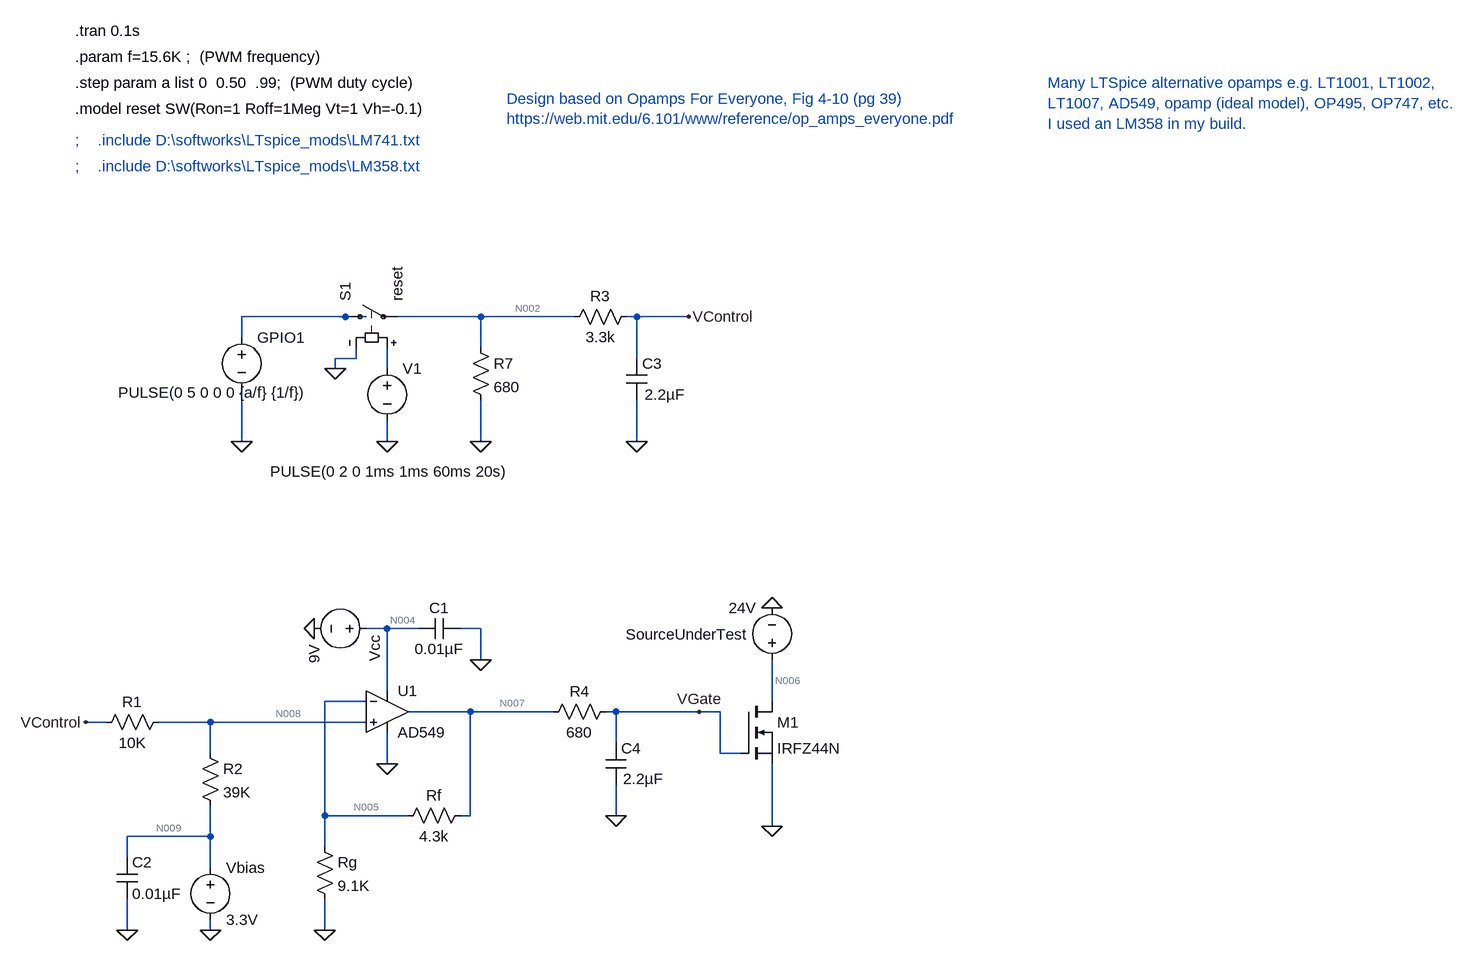
[diagram p0: schematic ConstCurrDriver.asc]
ConstCurrDriver.asc, the LTspice schematic file:
Version 4
SHEET 1 1688 1016
WIRE -928 48 -1088 48
WIRE -896 48 -928 48
WIRE -720 48 -848 48
WIRE -576 48 -720 48
WIRE -480 48 -496 48
WIRE -400 48 -480 48
WIRE -1088 80 -1088 48
WIRE -720 96 -720 48
WIRE -912 112 -912 96
WIRE -912 112 -944 112
WIRE -480 112 -480 48
WIRE -944 128 -944 112
WIRE -864 128 -864 96
WIRE -1088 240 -1088 160
WIRE -864 240 -864 208
WIRE -720 240 -720 176
WIRE -480 240 -480 176
WIRE -864 528 -896 528
WIRE -816 528 -864 528
WIRE -720 528 -752 528
WIRE -720 576 -720 528
WIRE -864 624 -864 528
WIRE -896 640 -960 640
WIRE -272 640 -272 576
WIRE -736 656 -832 656
WIRE -608 656 -736 656
WIRE -512 656 -528 656
WIRE -384 656 -512 656
WIRE -352 656 -384 656
WIRE -1296 672 -1328 672
WIRE -1136 672 -1216 672
WIRE -896 672 -1136 672
WIRE -512 704 -512 656
WIRE -1136 720 -1136 672
WIRE -352 720 -352 656
WIRE -320 720 -352 720
WIRE -864 736 -864 688
WIRE -960 816 -960 640
WIRE -832 816 -960 816
WIRE -736 816 -736 656
WIRE -736 816 -752 816
WIRE -512 816 -512 768
WIRE -272 832 -272 736
WIRE -1136 848 -1136 800
WIRE -1136 848 -1264 848
WIRE -960 864 -960 816
WIRE -1264 880 -1264 848
WIRE -1136 896 -1136 848
WIRE -1264 992 -1264 944
WIRE -1136 992 -1136 976
WIRE -960 992 -960 944
FLAG -1136 992 0
FLAG -960 992 0
FLAG -864 736 0
FLAG -720 576 0
FLAG -1264 992 0
FLAG -272 832 0
FLAG -480 240 0
FLAG -1088 240 0
FLAG -512 816 0
FLAG -864 240 0
FLAG -944 128 0
FLAG -976 528 0
FLAG -720 240 0
FLAG -272 496 0
FLAG -384 656 VGate
FLAG -400 48 VControl
FLAG -1328 672 VControl
SYMBOL voltage -1136 880 R0
WINDOW 123 0 0 Left 0
WINDOW 39 0 0 Left 0
SYMATTR InstName Vbias
SYMATTR Value 3.3V
SYMBOL res -736 800 R90
WINDOW 0 0 56 VBottom 2
WINDOW 3 32 56 VTop 2
SYMATTR InstName Rf
SYMATTR Value 4.3k
SYMBOL res -976 848 R0
SYMATTR InstName Rg
SYMATTR Value 9.1K
SYMBOL res -1152 704 R0
SYMATTR InstName R2
SYMATTR Value 39K
SYMBOL res -1200 656 R90
WINDOW 0 0 56 VBottom 2
WINDOW 3 32 56 VTop 2
SYMATTR InstName R1
SYMATTR Value 10K
SYMBOL cap -1280 880 R0
SYMATTR InstName C2
SYMATTR Value 0.01µF
SYMBOL cap -752 512 R90
WINDOW 0 0 32 VBottom 2
WINDOW 3 32 32 VTop 2
SYMATTR InstName C1
SYMATTR Value 0.01µF
SYMBOL nmos -320 640 R0
SYMATTR InstName M1
SYMATTR Value IRFZ44N
SYMBOL voltage -272 592 R180
WINDOW 123 0 0 Left 2
WINDOW 39 0 0 Left 2
WINDOW 0 35 55 Left 2
SYMATTR InstName SourceUnderTest
SYMATTR Value 24V
SYMBOL cap -496 112 R0
WINDOW 3 28 56 Left 2
SYMATTR Value 2.2µF
SYMATTR InstName C3
SYMBOL res -480 32 R90
WINDOW 0 0 56 VBottom 2
WINDOW 3 32 56 VTop 2
SYMATTR InstName R3
SYMATTR Value 3.3k
SYMBOL voltage -1088 64 R0
WINDOW 123 0 0 Left 2
WINDOW 39 0 0 Left 2
WINDOW 3 -190 101 Left 2
SYMATTR Value PULSE(0 5 0 0 0 {a/f} {1/f})
SYMATTR InstName GPIO1
SYMBOL res -512 640 R90
WINDOW 0 0 56 VBottom 2
WINDOW 3 32 56 VTop 2
SYMATTR InstName R4
SYMATTR Value 680
SYMBOL cap -528 704 R0
WINDOW 3 27 55 Left 2
SYMATTR Value 2.2µF
SYMATTR InstName C4
SYMBOL sw -944 48 R270
SYMATTR InstName S1
SYMATTR Value reset
SYMBOL voltage -864 112 R0
WINDOW 123 0 0 Left 0
WINDOW 39 0 0 Left 0
WINDOW 3 -180 174 Left 2
SYMATTR Value PULSE(0 2 0 1ms 1ms 60ms 20s)
SYMATTR InstName V1
SYMBOL voltage -880 528 R90
WINDOW 0 11 3 Left 2
WINDOW 123 0 0 Left 0
WINDOW 39 0 0 Left 0
SYMATTR InstName Vcc
SYMATTR Value 9V
SYMBOL res -736 80 R0
SYMATTR InstName R7
SYMATTR Value 680
SYMBOL Opamps\\AD549 -864 592 R0
SYMATTR InstName U1
TEXT -1344 -224 Left 2 ;;    .include D:\\softworks\\LTspice_mods\\LM741.txt
TEXT -680 -288 Left 2 ;Design based on Opamps For Everyone, Fig 4-10 (pg 39)\nhttps://web.mit.edu/6.101/www/reference/op_amps_everyone.pdf
TEXT -1344 -392 Left 2 !.tran 0.1s
TEXT -1344 -312 Left 2 !.step param a list 0  0.50  .99;  (PWM duty cycle)
TEXT -1344 -352 Left 2 !.param f=15.6K ;  (PWM frequency)
TEXT -1344 -272 Left 2 !.model reset SW(Ron=1 Roff=1Meg Vt=1 Vh=-0.1)
TEXT 152 -312 Left 2 ;Many LTSpice alternative opamps e.g. LT1001, LT1002, \nLT1007, AD549, opamp (ideal model), OP495, OP747, etc.\nI used an LM358 in my build.
TEXT -1344 -184 Left 2 ;;    .include D:\\softworks\\LTspice_mods\\LM358.txt

The netlist it stands for:
* ConstCurrDriver.asc
Vbias N009 0 3.3V
Rf N007 N005 4.3k
Rg N005 0 9.1K
R2 N008 N009 39K
R1 N008 VControl 10K
C2 N009 0 0.01µF
C1 0 N004 0.01µF
M1 N006 VGate 0 0 IRFZ44N
V§SourceUnderTest N006 0 24V
C3 VControl 0 2.2µF
R3 VControl N002 3.3k
V§GPIO1 N001 0 PULSE(0 5 0 0 0 {a/f} {1/f})
R4 VGate N007 680
C4 VGate 0 2.2µF
S1 N001 N002 N003 0 reset
V1 N003 0 PULSE(0 2 0 1ms 1ms 60ms 20s)
Vcc N004 0 9V
R7 N002 0 680
XU1 N008 N005 N004 0 N007 AD549  ; pins In+ In- V+ V- OUT
.model NMOS NMOS
.model PMOS PMOS
.lib standard.mos
* ;    .include D:\softworks\LTspice_mods\LM741.txt
* Design based on Opamps For Everyone, Fig 4-10 (pg 39)
* https://web.mit.edu/6.101/www/reference/op_amps_everyone.pdf
.tran 0.1s
.step param a list 0  0.50  .99;  (PWM duty cycle)
.param f=15.6K ;  (PWM frequency)
.model reset SW(Ron=1 Roff=1Meg Vt=1 Vh=-0.1)
* Many LTSpice alternative opamps e.g. LT1001, LT1002,
* LT1007, AD549, opamp (ideal model), OP495, OP747, etc.
* I used an LM358 in my build.
* ;    .include D:\softworks\LTspice_mods\LM358.txt
.backanno
.end

* Results of the author's LTspice run, read from the files saved beside the schematic
* Operating Point (first step), zero values left out:
*   V(n009) = 3.3 V
*   V(n007) = 1.396 V
*   V(n005) = 948.2 mV
*   V(n008) = 870.8 mV
*   V(vcontrol) = 247.9 mV
*   V(n004) = 9 V
*   V(n006) = 24 V
*   V(vgate) = 1.396 V
*   V(n002) = 42.33 mV
*   Id(M1) = 25.6 pA
*   Is(M1) = -25.6 pA
*   I(R7) = 62.25 µA
*   I(R3) = 62.29 µA
*   I(R1) = 62.29 µA
*   I(R2) = -62.29 µA
*   I(Rg) = 104.2 µA
*   I(Rf) = 104.2 µA
*   I(S1) = 42.33 nA
*   I(Vcc) = -866.3 µA
*   I(Gpio1) = 42.33 nA
*   I(Sourceundertest) = -50.02 pA
*   I(Vbias) = -62.29 µA
*   Ix(u1:3) = 866.3 µA
*   Ix(u1:4) = -762 µA
*   Ix(u1:5) = -104.2 µA